# EAGLE schematic 8700 orig 45deg (EAGLE 7.4.0)

## Sheet 1 of 2
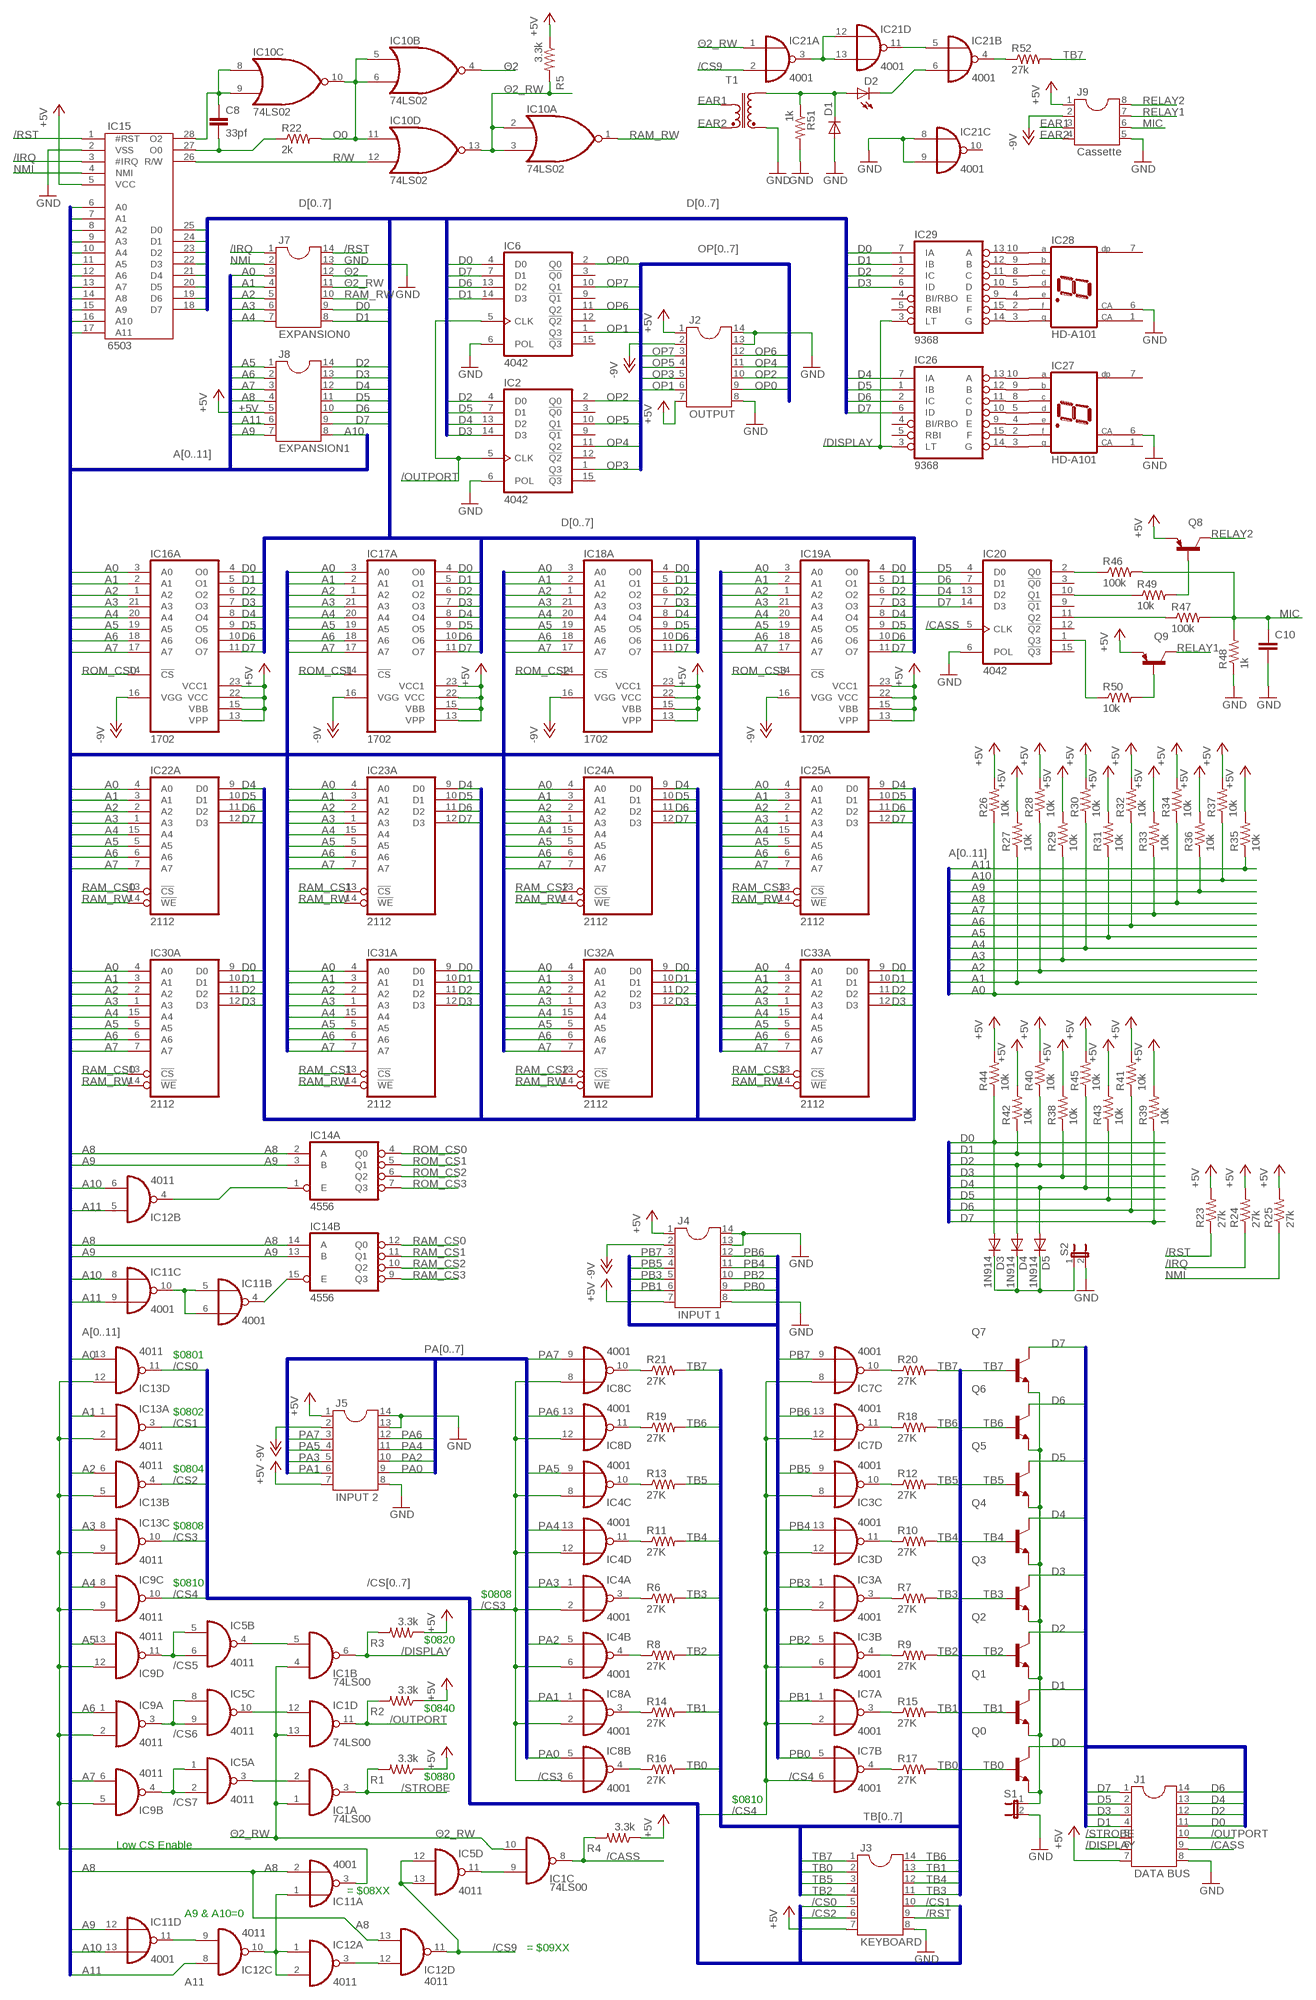
[diagram p0: schematic, sheet 1]

### Parts
C8  33pf  C-EU050-025X075  [C050-025X075]
C10  C-EU050-025X075  [C050-025X075]
D1  DIODE-DO07  [DO07]
D2  LED3MM  [LED3MM]
D3  1N914  DIODE-DO07  [DO07]
D4  1N914  DIODE-DO07  [DO07]
D5  1N914  DIODE-DO07  [DO07]
IC1  74LS00  74LS00N  [DIL14]
IC2  4042  4042N  [DIL16]
IC3  4001  4001N  [DIL14]
IC4  4001  4001N  [DIL14]
IC5  4011  4011N  [DIL14]
IC6  4042  4042N  [DIL16]
IC7  4001  4001N  [DIL14]
IC8  4001  4001N  [DIL14]
IC9  4011  4011N  [DIL14]
IC10  74LS02  74LS02N  [DIL14]
IC11  4001  4001N  [DIL14]
IC12  4011  4011N  [DIL14]
IC13  4011  4011N  [DIL14]
IC14  4556  4556N  [DIL16]
IC15  6503  [DIL28-6]
IC16  1702  [DIL24]
IC17  1702  [DIL24]
IC18  1702  [DIL24]
IC19  1702  [DIL24]
IC20  4042  4042N  [DIL16]
IC21  4001  4001N  [DIL14]
IC22  2112  [DIL16]
IC23  2112  [DIL16]
IC24  2112  [DIL16]
IC25  2112  [DIL16]
IC26  9368  7446N  [DIL16]
IC27  HD-A101  [HDSP-A]
IC28  HD-A101  [HDSP-A]
IC29  9368  7446N  [DIL16]
IC30  2112  [DIL16]
IC31  2112  [DIL16]
IC32  2112  [DIL16]
IC33  2112  [DIL16]
J1  DATA BUS  DIL14  [DIL14]
J2  OUTPUT  DIL14  [DIL14]
J3  KEYBOARD  DIL14  [DIL14]
J4  INPUT 1  DIL14  [DIL14]
J5  INPUT 2  DIL14  [DIL14]
J7  EXPANSION0  DIL14  [DIL14]
J8  EXPANSION1  DIL14  [DIL14]
J9  Cassette  DIL8  [DIL08]
Q0  2N3904-NPN-TO92-EBC  [TO92-EBC]
Q1  2N3904-NPN-TO92-EBC  [TO92-EBC]
Q2  2N3904-NPN-TO92-EBC  [TO92-EBC]
Q3  2N3904-NPN-TO92-EBC  [TO92-EBC]
Q4  2N3904-NPN-TO92-EBC  [TO92-EBC]
Q5  2N3904-NPN-TO92-EBC  [TO92-EBC]
Q6  2N3904-NPN-TO92-EBC  [TO92-EBC]
Q7  2N3904-NPN-TO92-EBC  [TO92-EBC]
Q8  2N3906-PNP-TO92-EBC  [TO92-EBC]
Q9  2N3906-PNP-TO92-EBC  [TO92-EBC]
R1  3.3k  R-US_0207/10  [0207/10]
R2  3.3k  R-US_0207/10  [0207/10]
R3  3.3k  R-US_0207/10  [0207/10]
R4  3.3k  R-US_0207/10  [0207/10]
R5  3.3k  R-US_0207/10  [0207/10]
R6  27K  R-US_0207/10  [0207/10]
R7  27K  R-US_0207/10  [0207/10]
R8  27K  R-US_0207/10  [0207/10]
R9  27K  R-US_0207/10  [0207/10]
R10  27K  R-US_0207/10  [0207/10]
R11  27K  R-US_0207/10  [0207/10]
R12  27K  R-US_0207/10  [0207/10]
R13  27K  R-US_0207/10  [0207/10]
R14  27K  R-US_0207/10  [0207/10]
R15  27K  R-US_0207/10  [0207/10]
R16  27K  R-US_0207/10  [0207/10]
R17  27K  R-US_0207/10  [0207/10]
R18  27K  R-US_0207/10  [0207/10]
R19  27K  R-US_0207/10  [0207/10]
R20  27K  R-US_0207/10  [0207/10]
R21  27K  R-US_0207/10  [0207/10]
R22  2k  R-US_0207/10  [0207/10]
R23  27k  R-US_0207/10  [0207/10]
R24  27k  R-US_0207/10  [0207/10]
R25  27k  R-US_0207/10  [0207/10]
R26  10k  R-US_0207/10  [0207/10]
R27  10k  R-US_0207/10  [0207/10]
R28  10k  R-US_0207/10  [0207/10]
R29  10k  R-US_0207/10  [0207/10]
R30  10k  R-US_0207/10  [0207/10]
R31  10k  R-US_0207/10  [0207/10]
R32  10k  R-US_0207/10  [0207/10]
R33  10k  R-US_0207/10  [0207/10]
R34  10k  R-US_0207/10  [0207/10]
R35  10k  R-US_0207/10  [0207/10]
R36  10k  R-US_0207/10  [0207/10]
R37  10k  R-US_0207/10  [0207/10]
R38  10k  R-US_0207/10  [0207/10]
R39  10k  R-US_0207/10  [0207/10]
R40  10k  R-US_0207/10  [0207/10]
R41  10k  R-US_0207/10  [0207/10]
R42  10k  R-US_0207/10  [0207/10]
R43  10k  R-US_0207/10  [0207/10]
R44  10k  R-US_0207/10  [0207/10]
R45  10k  R-US_0207/10  [0207/10]
R46  100k  R-US_0207/10  [0207/10]
R47  100k  R-US_0207/10  [0207/10]
R48  1k  R-US_0207/10  [0207/10]
R49  10k  R-US_0207/10  [0207/10]
R50  10k  R-US_0207/10  [0207/10]
R51  1k  R-US_0207/10  [0207/10]
R52  27k  R-US_0207/10  [0207/10]
S1  JUMPER  [JUMPER]
S2  JUMPER  [JUMPER]
T1  TRANSF  [TRANSF]

### Nets
+5V: IC15.5(VCC) IC16.13(A:VPP) IC16.15(A:VBB) IC16.22(A:VCC) IC16.23(A:VCC1) IC17.13(A:VPP) IC17.15(A:VBB) IC17.22(A:VCC) IC17.23(A:VCC1) IC18.13(A:VPP) IC18.15(A:VBB) IC18.22(A:VCC) IC18.23(A:VCC1) IC19.13(A:VPP) IC19.15(A:VBB) IC19.22(A:VCC) IC19.23(A:VCC1) J1.7 J2.1 J2.7 J3.7 J4.1 J4.7 J5.1 J5.7 J8.5 J9.1 Q8.E Q9.E R1.1 R2.1 R3.1 R4.1 R5.1 R23.2 R24.2 R25.2 R26.2 R27.2 R28.2 R29.2 R30.2 R31.2 R32.2 R33.2 R34.2 R35.2 R36.2 R37.2 R38.2 R39.2 R40.2 R41.2 R42.2 R43.2 R44.2 R45.2 ; also sheet 2
-9V: IC16.16(A:VGG) IC17.16(A:VGG) IC18.16(A:VGG) IC19.16(A:VGG) J2.2 J4.2 J5.2 J9.2 ; also sheet 2
/CASS: IC1.8(C:O) IC20.5(CLK) J1.9 R4.2
/CS0: IC13.11(D:O) J3.5
/CS1: IC13.3(A:O) J3.10
/CS2: IC13.4(B:O) J3.6
/CS3: IC4.2(A:I1) IC4.6(B:I1) IC4.8(C:I0) IC4.12(D:I0) IC8.2(A:I1) IC8.6(B:I1) IC8.8(C:I0) IC8.12(D:I0) IC13.10(C:O)
/CS4: IC3.2(A:I1) IC3.6(B:I1) IC3.8(C:I0) IC3.12(D:I0) IC7.2(A:I1) IC7.6(B:I1) IC7.8(C:I0) IC7.12(D:I0) IC9.10(C:O)
/CS5: IC5.5(B:I0) IC5.6(B:I1) IC9.11(D:O)
/CS6: IC5.8(C:I0) IC5.9(C:I1) IC9.3(A:O)
/CS7: IC5.1(A:I0) IC5.2(A:I1) IC9.4(B:O)
/CS9: IC5.12(D:I0) IC5.13(D:I1) IC12.11(D:O) IC21.2(A:I1)
/DISPLAY: IC1.6(B:O) IC26.3(LT) IC29.3(LT) J1.6 R3.2
/IRQ: IC15.3(#IRQ) J7.1 R24.1
/OUTPORT: IC1.11(D:O) IC2.5(CLK) IC6.5(CLK) J1.10 R2.2
/RST: IC15.1(#RST) J3.9 J7.14 R23.1
/STROBE: IC1.3(A:O) J1.5 R1.2
A0: IC13.13(D:I1) IC15.6(A0) IC16.3(A:A0) IC17.3(A:A0) IC18.3(A:A0) IC19.3(A:A0) IC22.4(A:A0) IC23.4(A:A0) IC24.4(A:A0) IC25.4(A:A0) IC30.4(A:A0) IC31.4(A:A0) IC32.4(A:A0) IC33.4(A:A0) J7.3 R26.1
A1: IC13.1(A:I0) IC15.7(A1) IC16.2(A:A1) IC17.2(A:A1) IC18.2(A:A1) IC19.2(A:A1) IC22.3(A:A1) IC23.3(A:A1) IC24.3(A:A1) IC25.3(A:A1) IC30.3(A:A1) IC31.3(A:A1) IC32.3(A:A1) IC33.3(A:A1) J7.4 R27.1
A2: IC13.6(B:I1) IC15.8(A2) IC16.1(A:A2) IC17.1(A:A2) IC18.1(A:A2) IC19.1(A:A2) IC22.2(A:A2) IC23.2(A:A2) IC24.2(A:A2) IC25.2(A:A2) IC30.2(A:A2) IC31.2(A:A2) IC32.2(A:A2) IC33.2(A:A2) J7.5 R28.1
A3: IC13.8(C:I0) IC15.9(A3) IC16.21(A:A3) IC17.21(A:A3) IC18.21(A:A3) IC19.21(A:A3) IC22.1(A:A3) IC23.1(A:A3) IC24.1(A:A3) IC25.1(A:A3) IC30.1(A:A3) IC31.1(A:A3) IC32.1(A:A3) IC33.1(A:A3) J7.6 R29.1
A4: IC9.8(C:I0) IC15.10(A4) IC16.20(A:A4) IC17.20(A:A4) IC18.20(A:A4) IC19.20(A:A4) IC22.15(A:A4) IC23.15(A:A4) IC24.15(A:A4) IC25.15(A:A4) IC30.15(A:A4) IC31.15(A:A4) IC32.15(A:A4) IC33.15(A:A4) J7.7 R30.1
A5: IC9.13(D:I1) IC15.11(A5) IC16.19(A:A5) IC17.19(A:A5) IC18.19(A:A5) IC19.19(A:A5) IC22.5(A:A5) IC23.5(A:A5) IC24.5(A:A5) IC25.5(A:A5) IC30.5(A:A5) IC31.5(A:A5) IC32.5(A:A5) IC33.5(A:A5) J8.1 R31.1
A6: IC9.1(A:I0) IC15.12(A6) IC16.18(A:A6) IC17.18(A:A6) IC18.18(A:A6) IC19.18(A:A6) IC22.6(A:A6) IC23.6(A:A6) IC24.6(A:A6) IC25.6(A:A6) IC30.6(A:A6) IC31.6(A:A6) IC32.6(A:A6) IC33.6(A:A6) J8.2 R32.1
A7: IC9.6(B:I1) IC15.13(A7) IC16.17(A:A7) IC17.17(A:A7) IC18.17(A:A7) IC19.17(A:A7) IC22.7(A:A7) IC23.7(A:A7) IC24.7(A:A7) IC25.7(A:A7) IC30.7(A:A7) IC31.7(A:A7) IC32.7(A:A7) IC33.7(A:A7) J8.3 R33.1
A8: IC11.2(A:I1) IC12.13(D:I1) IC14.2(A:A) IC14.14(B:A) IC15.14(A8) J8.4 R34.1
A9: IC11.12(D:I0) IC14.3(A:B) IC14.13(B:B) IC15.15(A9) J8.7 R36.1
A10: IC11.8(C:I0) IC11.13(D:I1) IC12.6(B:I1) IC15.16(A10) J8.8 R37.1
A11: IC11.9(C:I1) IC12.5(B:I0) IC12.8(C:I0) IC15.17(A11) J8.6 R35.1
D0: D3.A IC6.4(D0) IC15.25(D0) IC16.4(A:O0) IC17.4(A:O0) IC18.4(A:O0) IC19.4(A:O0) IC29.7(IA) IC30.9(A:D0) IC31.9(A:D0) IC32.9(A:D0) IC33.9(A:D0) J1.11 J7.9 Q0.C R44.1
D1: IC6.14(D3) IC15.24(D1) IC16.5(A:O1) IC17.5(A:O1) IC18.5(A:O1) IC19.5(A:O1) IC29.1(IB) IC30.10(A:D1) IC31.10(A:D1) IC32.10(A:D1) IC33.10(A:D1) J1.4 J7.8 Q1.C R42.1
D2: D4.A IC2.4(D0) IC15.23(D2) IC16.6(A:O2) IC17.6(A:O2) IC18.6(A:O2) IC19.6(A:O2) IC29.2(IC) IC30.11(A:D2) IC31.11(A:D2) IC32.11(A:D2) IC33.11(A:D2) J1.12 J8.14 Q2.C R40.1
D3: IC2.14(D3) IC15.22(D3) IC16.7(A:O3) IC17.7(A:O3) IC18.7(A:O3) IC19.7(A:O3) IC29.6(ID) IC30.12(A:D3) IC31.12(A:D3) IC32.12(A:D3) IC33.12(A:D3) J1.3 J8.13 Q3.C R38.1
D4: D5.A IC2.13(D2) IC15.21(D4) IC16.8(A:O4) IC17.8(A:O4) IC18.8(A:O4) IC19.8(A:O4) IC20.13(D2) IC22.9(A:D0) IC23.9(A:D0) IC24.9(A:D0) IC25.9(A:D0) IC26.7(IA) J1.13 J8.12 Q4.C R45.1
D5: IC2.7(D1) IC15.20(D5) IC16.9(A:O5) IC17.9(A:O5) IC18.9(A:O5) IC19.9(A:O5) IC20.4(D0) IC22.10(A:D1) IC23.10(A:D1) IC24.10(A:D1) IC25.10(A:D1) IC26.1(IB) J1.2 J8.11 Q5.C R43.1
D6: IC6.13(D2) IC15.19(D6) IC16.10(A:O6) IC17.10(A:O6) IC18.10(A:O6) IC19.10(A:O6) IC20.7(D1) IC22.11(A:D2) IC23.11(A:D2) IC24.11(A:D2) IC25.11(A:D2) IC26.2(IC) J1.14 J8.10 Q6.C R41.1
D7: IC6.7(D1) IC15.18(D7) IC16.11(A:O7) IC17.11(A:O7) IC18.11(A:O7) IC19.11(A:O7) IC20.14(D3) IC22.12(A:D3) IC23.12(A:D3) IC24.12(A:D3) IC25.12(A:D3) IC26.6(ID) J1.1 J8.9 Q7.C R39.1
EAR1: J9.3 T1.P$1(P1)
EAR2: J9.4 T1.P$2(P2)
GND: C10.2 D1.A IC2.6(POL) IC6.6(POL) IC15.2(VSS) IC20.6(POL) IC21.8(C:I0) IC21.9(C:I1) IC27.6(CA) IC28.6(CA) J1.8 J2.8 J2.13 J2.14 J3.8 J4.8 J4.13 J4.14 J5.8 J5.13 J5.14 J7.13 J9.5 R48.1 R51.2 S1.2 S2.2 T1.P$5(S1) ; also sheet 2
MIC: C10.1 J9.6 R46.2 R47.2 R48.2
N$1: C8.1 IC10.8(C:I0) IC10.9(C:I1) IC15.28(O2)
N$2: IC21.3(A:O) IC21.12(D:I0) IC21.13(D:I1)
N$3: C8.2 IC15.27(O0) R22.1
N$4: D2.K(C) IC21.6(B:I1)
N$5: IC21.5(B:I0) IC21.11(D:O)
N$6: IC21.4(B:O) R52.1
N$7: Q0.E Q1.E Q2.E Q3.E Q4.E Q5.E Q6.E Q7.E S1.1
N$8: IC9.2(A:I1) IC9.5(B:I0) IC9.9(C:I1) IC9.12(D:I0) IC11.3(A:O) IC13.2(A:I1) IC13.5(B:I0) IC13.9(C:I1) IC13.12(D:I0)
N$9: IC1.2(A:I1) IC5.3(A:O)
N$10: IC1.5(B:I1) IC5.4(B:O)
N$11: IC12.4(B:O) IC14.1(A:E)
N$12: IC11.5(B:I0) IC11.6(B:I1) IC11.10(C:O)
N$13: IC1.12(D:I0) IC5.10(C:O)
N$14: IC11.4(B:O) IC14.15(B:E)
N$15: IC11.11(D:O) IC12.9(C:I1)
N$16: IC11.1(A:I0) IC12.1(A:I0) IC12.2(A:I1) IC12.10(C:O)
N$17: IC12.3(A:O) IC12.12(D:I0)
N$18: IC1.9(C:I0) IC5.11(D:O)
N$19: IC8.3(A:O) R14.1
N$20: IC8.4(B:O) R16.1
N$21: IC20.11(Q2) R47.1
N$21`: IC4.4(B:O) R8.1
N$22: IC4.3(A:O) R6.1
N$23: IC4.11(D:O) R11.1
N$24: IC4.10(C:O) R13.1
N$25: IC8.11(D:O) R19.1
N$26: IC8.10(C:O) R21.1
N$27: IC7.4(B:O) R17.1
N$28: IC7.3(A:O) R15.1
N$29: IC3.4(B:O) R9.1
N$30: IC3.3(A:O) R7.1
N$31: IC3.11(D:O) R10.1
N$32: IC3.10(C:O) R12.1
N$33: IC7.11(D:O) R18.1
N$34: IC7.10(C:O) R20.1
N$35: IC20.1(Q3) R50.1
N$36: IC28.2(F) IC29.15(F)
N$37: IC28.5(D) IC29.10(D)
N$38: Q9.B R50.2
N$39: Q8.B R49.2
N$40: IC28.9(B) IC29.12(B)
N$41: IC28.10(A) IC29.13(A)
N$42: IC20.2(Q0) R46.1
N$43: IC20.10(Q1) R49.1
N$44: IC28.8(C) IC29.11(C)
N$45: IC28.4(E) IC29.9(E)
N$46: IC28.3(G) IC29.14(G)
N$47: IC26.15(F) IC27.2(F)
N$48: IC26.10(D) IC27.5(D)
N$49: IC26.12(B) IC27.9(B)
N$50: IC26.13(A) IC27.10(A)
N$51: IC26.11(C) IC27.8(C)
N$52: IC26.9(E) IC27.4(E)
N$53: IC26.14(G) IC27.3(G)
N$54: D3.C D4.C D5.C S2.1
N$55: D1.C D2.A R51.1 T1.P$3(S2)
NMI: IC15.4(NMI) J7.2 R25.1
O0: IC10.5(B:I0) IC10.6(B:I1) IC10.10(C:O) IC10.11(D:I0) R22.2
OP0: IC6.2(Q0) J2.9
OP1: IC6.1(Q3) J2.6
OP2: IC2.2(Q0) J2.10
OP3: IC2.1(Q3) J2.5
OP4: IC2.11(Q2) J2.11
OP5: IC2.10(Q1) J2.4
OP6: IC6.11(Q2) J2.12
OP7: IC6.10(Q1) J2.3
PA0: IC8.5(B:I0) J5.9
PA1: IC8.1(A:I0) J5.6
PA2: IC4.5(B:I0) J5.10
PA3: IC4.1(A:I0) J5.5
PA4: IC4.13(D:I1) J5.11
PA5: IC4.9(C:I1) J5.4
PA6: IC8.13(D:I1) J5.12
PA7: IC8.9(C:I1) J5.3
PB0: IC7.5(B:I0) J4.9
PB1: IC7.1(A:I0) J4.6
PB2: IC3.5(B:I0) J4.10
PB3: IC3.1(A:I0) J4.5
PB4: IC3.13(D:I1) J4.11
PB5: IC3.9(C:I1) J4.4
PB6: IC7.13(D:I1) J4.12
PB7: IC7.9(C:I1) J4.3
R/W: IC10.12(D:I1) IC15.26(R/W)
RAM_CS0: IC14.12(B:Q0) IC22.13(A:!CS) IC30.13(A:!CS)
RAM_CS1: IC14.11(B:Q1) IC23.13(A:!CS) IC31.13(A:!CS)
RAM_CS2: IC14.10(B:Q2) IC24.13(A:!CS) IC32.13(A:!CS)
RAM_CS3: IC14.9(B:Q3) IC25.13(A:!CS) IC33.13(A:!CS)
RAM_RW: IC10.1(A:O) IC22.14(A:!WE) IC23.14(A:!WE) IC24.14(A:!WE) IC25.14(A:!WE) IC30.14(A:!WE) IC31.14(A:!WE) IC32.14(A:!WE) IC33.14(A:!WE) J7.10
RELAY1: J9.7 Q9.C
RELAY2: J9.8 Q8.C
ROM_CS0: IC14.4(A:Q0) IC16.14(A:!CS)
ROM_CS1: IC14.5(A:Q1) IC17.14(A:!CS)
ROM_CS2: IC14.6(A:Q2) IC18.14(A:!CS)
ROM_CS3: IC14.7(A:Q3) IC19.14(A:!CS)
TB0: J3.2 Q0.B R16.2 R17.2
TB1: J3.13 Q1.B R14.2 R15.2
TB2: J3.4 Q2.B R8.2 R9.2
TB3: J3.11 Q3.B R6.2 R7.2
TB4: J3.12 Q4.B R10.2 R11.2
TB5: J3.3 Q5.B R12.2 R13.2
TB6: J3.14 Q6.B R18.2 R19.2
TB7: J3.1 Q7.B R20.2 R21.2 R52.2
Θ2: IC10.4(B:O) J7.12
Θ2_RW: IC1.1(A:I0) IC1.4(B:I0) IC1.10(C:I1) IC1.13(D:I1) IC10.2(A:I0) IC10.3(A:I1) IC10.13(D:O) IC21.1(A:I0) J7.11 R5.2
Unconnected: IC2.3(!Q0) IC2.9(!Q1) IC2.12(!Q2) IC2.15(!Q3) IC6.3(!Q0) IC6.9(!Q1) IC6.12(!Q2) IC6.15(!Q3) IC20.3(!Q0) IC20.9(!Q1) IC20.12(!Q2) IC20.15(!Q3) IC21.10(C:O) IC26.4(BI/RBO) IC26.5(RBI) IC27.1(CA) IC27.7(DP) IC28.1(CA) IC28.7(DP) IC29.4(BI/RBO) IC29.5(RBI)

### Buses
D[0..7]
A[0..11]
OP[0..7]
/CS[0..7]
PA[0..7]
TB[0..7]
PB[0..7]

### Notes on the sheet
- $0801
- $0802
- $0804
- $0808
- $0810
- $0808
- $0820
- $0840
- $0880
- $0810
- Low CS Enable
- = $08XX
- A9 & A10=0
- = $09XX

## Sheet 2 of 2: Power
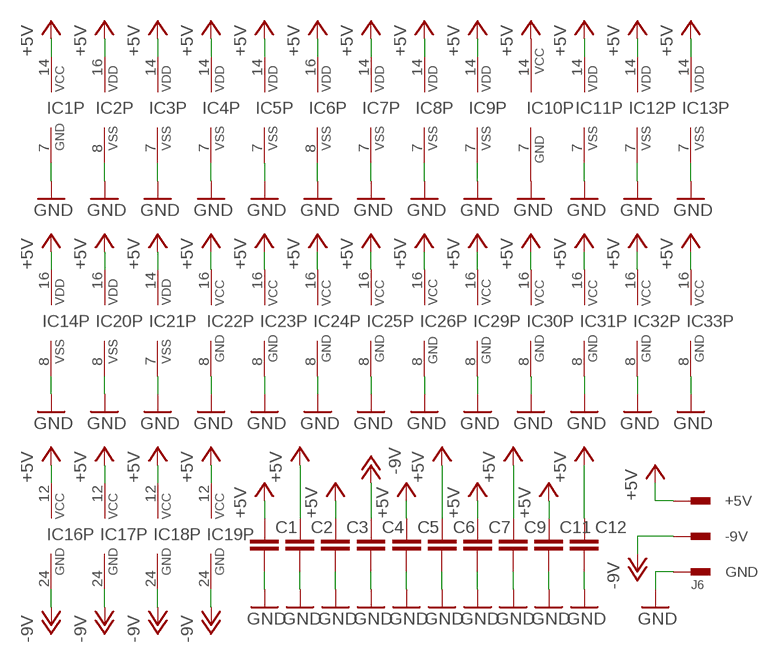
[diagram p1: schematic, sheet 2]

### Parts
C1  C-EU050-025X075  [C050-025X075]
C2  C-EU050-025X075  [C050-025X075]
C3  C-EU050-025X075  [C050-025X075]
C4  C-EU050-025X075  [C050-025X075]
C5  C-EU050-025X075  [C050-025X075]
C6  C-EU050-025X075  [C050-025X075]
C7  C-EU050-025X075  [C050-025X075]
C9  C-EU050-025X075  [C050-025X075]
C11  C-EU050-025X075  [C050-025X075]
C12  C-EU050-025X075  [C050-025X075]
J6  POWER  [POWER]

### Nets
+5V: C1.1 C2.1 C3.1 C5.1 C6.1 C7.1 C9.1 C11.1 C12.1 IC1.14(P:VCC) IC2.16(VDD) IC3.14(P:VDD) IC4.14(P:VDD) IC5.14(P:VDD) IC6.16(VDD) IC7.14(P:VDD) IC8.14(P:VDD) IC9.14(P:VDD) IC10.14(P:VCC) IC11.14(P:VDD) IC12.14(P:VDD) IC13.14(P:VDD) IC14.16(P:VDD) IC16.12(P:VCC) IC17.12(P:VCC) IC18.12(P:VCC) IC19.12(P:VCC) IC20.16(VDD) IC21.14(P:VDD) IC22.16(P:VCC) IC23.16(P:VCC) IC24.16(P:VCC) IC25.16(P:VCC) IC26.16(VCC) IC29.16(VCC) IC30.16(P:VCC) IC31.16(P:VCC) IC32.16(P:VCC) IC33.16(P:VCC) J6.P$1(+5V) ; also sheet 1
-9V: C4.1 IC16.24(P:GND) IC17.24(P:GND) IC18.24(P:GND) IC19.24(P:GND) J6.P$2(-9V) ; also sheet 1
GND: C1.2 C2.2 C3.2 C4.2 C5.2 C6.2 C7.2 C9.2 C11.2 C12.2 IC1.7(P:GND) IC2.8(VSS) IC3.7(P:VSS) IC4.7(P:VSS) IC5.7(P:VSS) IC6.8(VSS) IC7.7(P:VSS) IC8.7(P:VSS) IC9.7(P:VSS) IC10.7(P:GND) IC11.7(P:VSS) IC12.7(P:VSS) IC13.7(P:VSS) IC14.8(P:VSS) IC20.8(VSS) IC21.7(P:VSS) IC22.8(P:GND) IC23.8(P:GND) IC24.8(P:GND) IC25.8(P:GND) IC26.8(GND) IC29.8(GND) IC30.8(P:GND) IC31.8(P:GND) IC32.8(P:GND) IC33.8(P:GND) J6.P$3(GND) ; also sheet 1

## Library data of the parts
C1-C12 = rcl:C-EU: CAPACITOR, European symbol
D1 D3-D5 = diode:DIODE-: DIODE
D2 = led:LED: LED OSRAM: - CHIPLED LG R971, LG N971, LY N971, LG Q971, LY Q971, LO R971, LY R971 LH N974, LH R974 LS Q976, LO Q976, LY Q976 LO Q996 - Hyper CHIPLED LW Q18S LB Q993, LB Q99A, LB R99A - SideLED LS A670, LO A670, LY A670, LG A670, LP A670 LB A673, LV A673, LT A673, LW A673 LH A674 LY A675 LS A676, LA A676, LO A676, LY A676, LW A676 LS A679, LY A679, LG A679 - Hyper Micro SIDELED® LS Y876, LA Y876, LO Y876, LY Y876 LT Y87S - SmartLED LW L88C, LW L88S LB L89C, LB L89S, LG L890 LS L89K, LO L89K, LY L89K LS L896, LA L896, LO L896, LY L896 - TOPLED LS T670, LO T670, LY T670, LG T670, LP T670 LSG T670, LSP T670, LSY T670, LOP T670, LYG T670 LG T671, LOG T671, LSG T671 LB T673, LV T673, LT T673, LW T673 LH T674 LS T676, LA T676, LO T676, LY T676, LB T676, LH T676, LSB T676, LW T676 LB T67C, LV T67C, LT T67C, LS T67K, LO T67K, LY T67K, LW E67C LS E67B, LA E67B, LO E67B, LY E67B, LB E67C, LV E67C, LT E67C LW T67C LS T679, LY T679, LG T679 LS T770, LO T770, LY T770, LG T770, LP T770 LB T773, LV T773, LT T773, LW T773 LH T774 LS E675, LA E675, LY E675, LS T675 LS T776, LA T776, LO T776, LY T776, LB T776 LHGB T686 LT T68C, LB T68C - Hyper Mini TOPLED® LB M676 - Mini TOPLED Santana® LG M470 LS M47K, LO M47K, LY M47K Source: http://www.osram.convergy.de LUXEON: - LUMILED® LXK2-PW12-R00, LXK2-PW12-S00, LXK2-PW14-U00, LXK2-PW14-V00 LXK2-PM12-R00, LXK2-PM12-S00, LXK2-PM14-U00 LXK2-PE12-Q00, LXK2-PE12-R00, LXK2-PE12-S00, LXK2-PE14-T00, LXK2-PE14-U00 LXK2-PB12-K00, LXK2-PB12-L00, LXK2-PB12-M00, LXK2-PB14-N00, LXK2-PB14-P00, LXK2-PB14-Q00 LXK2-PR12-L00, LXK2-PR12-M00, LXK2-PR14-Q00, LXK2-PR14-R00 LXK2-PD12-Q00, LXK2-PD12-R00, LXK2-PD12-S00 LXK2-PH12-R00, LXK2-PH12-S00 LXK2-PL12-P00, LXK2-PL12-Q00, LXK2-PL12-R00 Source: www.luxeon.com KINGBRIGHT: KA-3528ASYC Source: www.kingbright.com
IC1 = 74xx-eu:74*00: Quad 2-input NAND gate
IC2 IC6 IC20 = 40xx:4042: Quad clocked D LATCH
IC3 IC4 IC7 IC8 IC11 IC21 = 40xx:4001: Quad 2-input NOR
IC5 IC9 IC12 IC13 = 40xx:4011: Quad 2-input NAND
IC10 = 74xx-us:74*02: Quad 2-input NOR gate
IC14 = 45xx:4556: Dual binary 1 of 4 DECODER INVERTER
IC15 = Mos6503:6503: * 4K Addressable Bytes of Memory (A0-A11)y * On Chip Clock * IRQ and NMI * 8bit Bi-Dir Data Bus
IC16-IC19 = memory:1702
IC22-IC25 IC30-IC33 = memory:2112
IC26 IC29 = 74xx-eu:74*46: BCD to seven segment DECODER/DRIVER, open collector
IC27 IC28 = display-hp:HD-A101: LED DISPLAY 1-character 7 segment, decimal point right; OC_FARNELL: unknown; OC_NEWARK: unknown
J1-J5 J7 J8 = ic-package:DIL14: Dual In Line / Socket
J6 = PAiA 8700:POWER
J9 = ic-package:DIL8: Dual In Line / Socket
Q0 Q1-Q7 = transistor-neu-to92:*-NPN-: NPN Transistror
Q8 Q9 = transistor-neu-to92:*-PNP-: PNP Transistror
R1-R52 = rcl:R-US_: RESISTOR, American symbol
S1 S2 = PAiA 8700:JUMPER
T1 = PAiA 8700:TRANSF